# Altium schematic sheet power.SchDoc
size A4
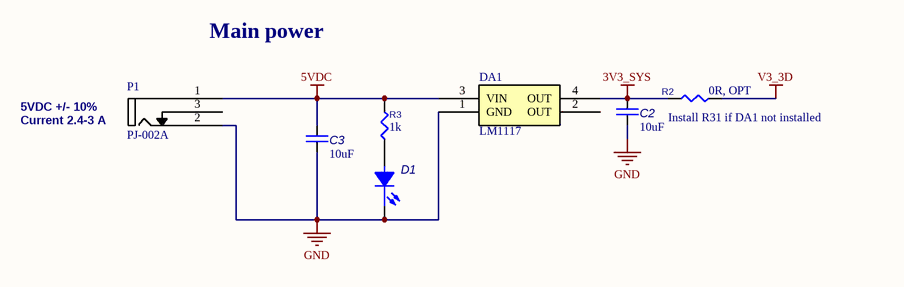
[diagram p0: power.SchDoc]

## Parts
C2  value 10uF  [CC2012-0805]  (hidden comment: C0805)
C3  value 10uF  [CC2012-0805]  (hidden comment: C0805)
D1  LED0805  [LED0805]  (value not drawn)
DA1  LM1117  [SOT230P700X160-4N]
P1  PJ-002A  [PJ-002A]
R2  value 0R, OPT  [RESC1608X55N]  (hidden comment: R0603)
R3  value 1k  [RESC1608X55N]  (hidden comment: R0603)

## Nets
3V3_SYS: C2.2 DA1.4(OUT) R2.1
5VDC: C3.2 DA1.3(VIN) P1.1(GND) R3.2
GND: C2.1 C3.1 D1.K(C) DA1.1(GND) P1.2(RIGHT)
V3_3D: R2.2
NetD1_A: D1.A R3.1

Not connected (* = marked no-connect by the designer): DA1 2(OUT); P1 3(LEFT)

## Notes on the sheet
- Main power
- 5VDC +/- 10%
  Current 2.4-3 A
- (near R2) Install R31 if DA1 not installed

## Library data of the parts
D1 = LED0805: LED 0805; Value: *
DA1 = LM1117: 800mA Low-Dropout Linear Regulator; Manufacturer: National; Man P/N: LM1117IMPX-3.3, OPT; Package: 3-lead  SOT-223
P1 = PJ-002A: DC POWER JACK; Manufacturer: CIU Inc; Vendor: Digi-key; Alternative P/N: DJK-02A; Man P/N: PJ-002A
C2 C3 = C0805: P/N: *
R2 R3 = R0603: P/N: *